# EAGLE design M228pnames (EAGLE 6.6.0)
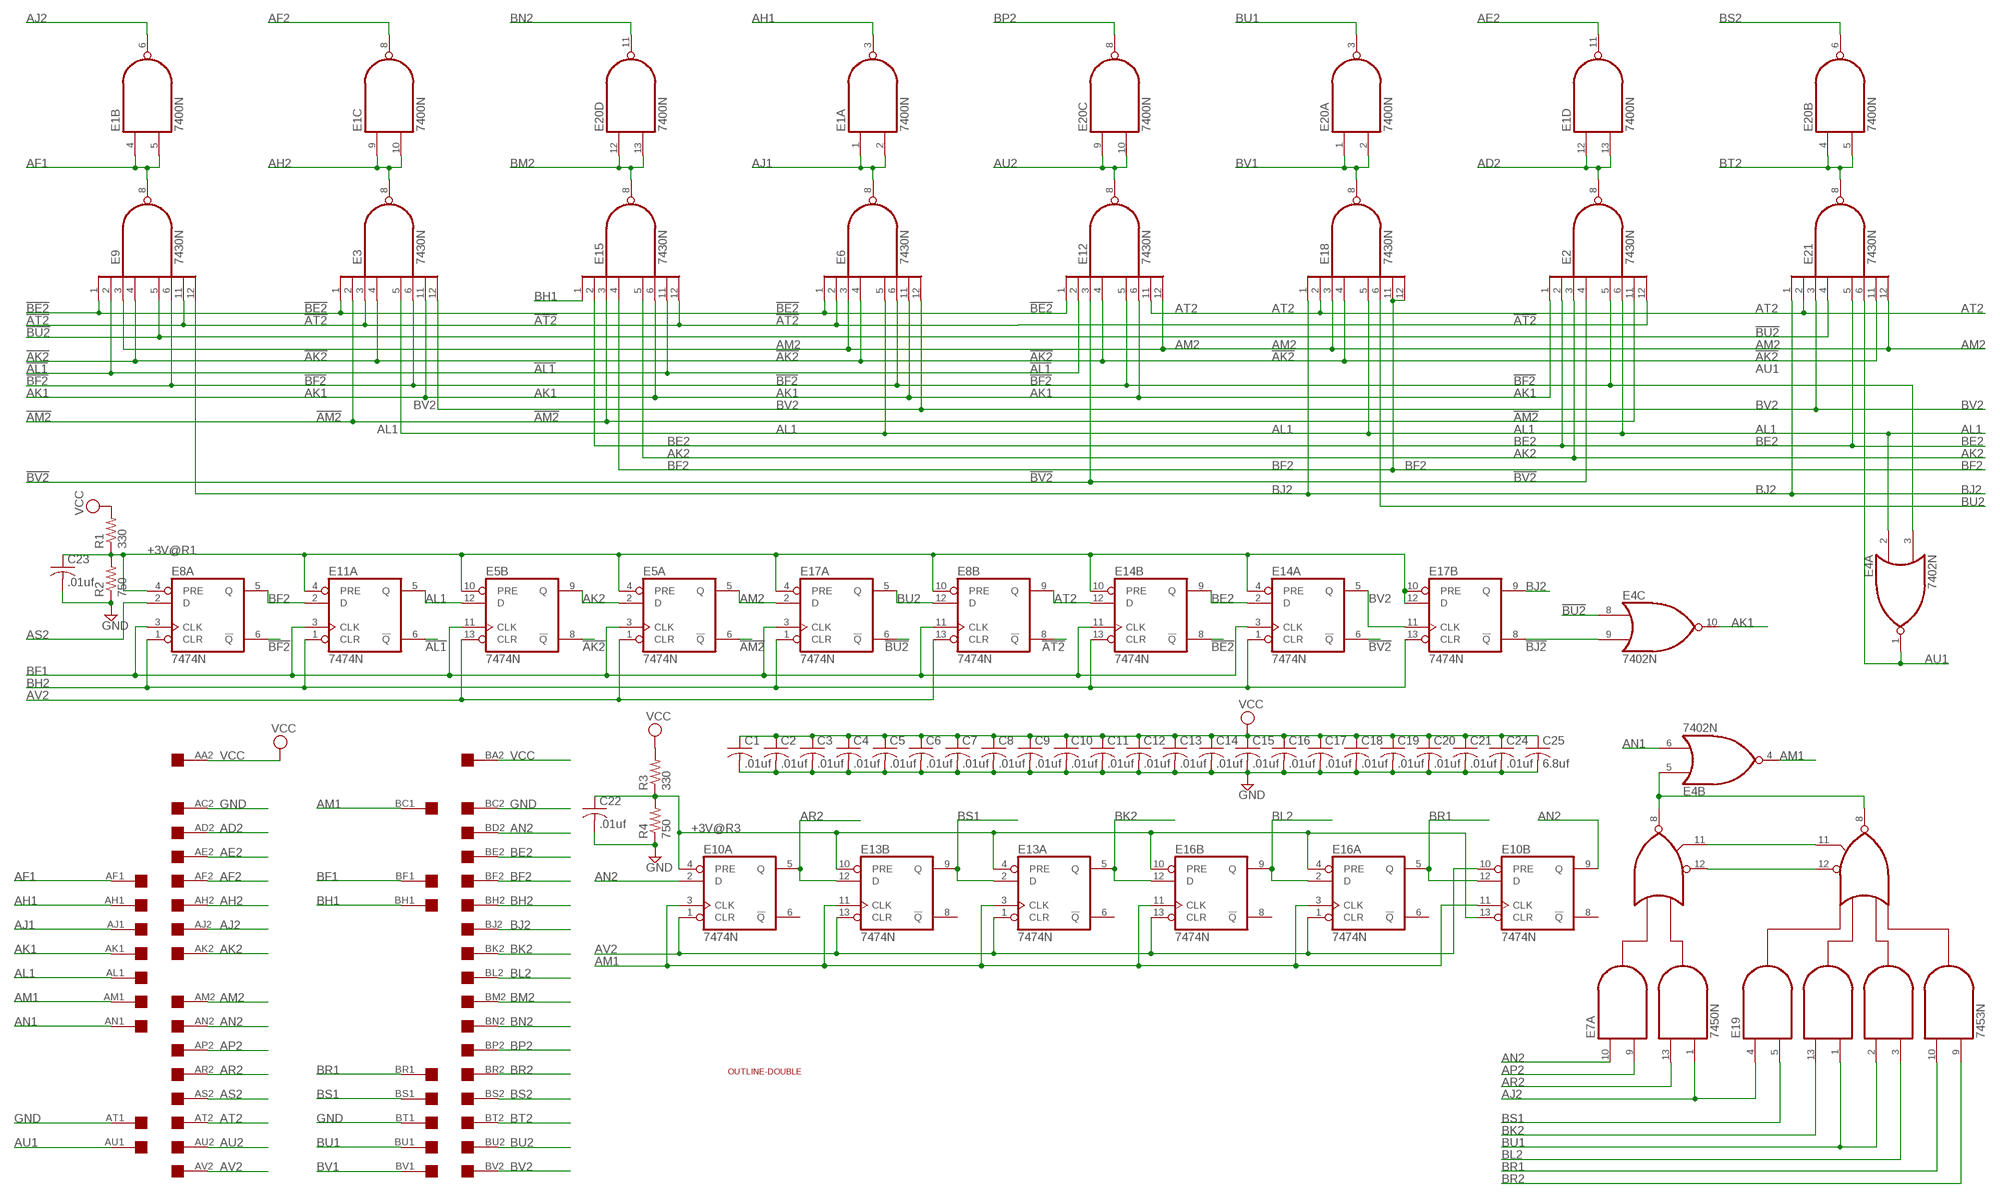
[diagram p0: schematic, sheet 1]

## Parts
C1  .01uf  C-US050-025X075  [C050-025X075]
C2  .01uf  C-US050-025X075  [C050-025X075]
C3  .01uf  C-US050-025X075  [C050-025X075]
C4  .01uf  C-US050-025X075  [C050-025X075]
C5  .01uf  C-US050-025X075  [C050-025X075]
C6  .01uf  C-US050-025X075  [C050-025X075]
C7  .01uf  C-US050-025X075  [C050-025X075]
C8  .01uf  C-US050-025X075  [C050-025X075]
C9  .01uf  C-US050-025X075  [C050-025X075]
C10  .01uf  C-US050-025X075  [C050-025X075]
C11  .01uf  C-US050-025X075  [C050-025X075]
C12  .01uf  C-US050-025X075  [C050-025X075]
C13  .01uf  C-US050-025X075  [C050-025X075]
C14  .01uf  C-US050-025X075  [C050-025X075]
C15  .01uf  C-US050-025X075  [C050-025X075]
C16  .01uf  C-US050-025X075  [C050-025X075]
C17  .01uf  C-US050-025X075  [C050-025X075]
C18  .01uf  C-US050-025X075  [C050-025X075]
C19  .01uf  C-US050-025X075  [C050-025X075]
C20  .01uf  C-US050-025X075  [C050-025X075]
C21  .01uf  C-US050-025X075  [C050-025X075]
C22  .01uf  C-US050-025X075  [C050-025X075]
C23  .01uf  C-US050-025X075  [C050-025X075]
C24  .01uf  C-US050-025X075  [C050-025X075]
C25  6.8uf  C-US150-054X183  [C150-054X183]
E1  7400N  [DIL14]
E2  7430N  [DIL14]
E3  7430N  [DIL14]
E4  7402N  [DIL14]
E5  7474N  74S74N  [DIL14]
E6  7430N  [DIL14]
E7  7450N  [DIL14]
E8  7474N  74S74N  [DIL14]
E9  7430N  [DIL14]
E10  7474N  74S74N  [DIL14]
E11  7474N  74S74N  [DIL14]
E12  7430N  [DIL14]
E13  7474N  74S74N  [DIL14]
E14  7474N  74S74N  [DIL14]
E15  7430N  [DIL14]
E16  7474N  74S74N  [DIL14]
E17  7474N  74S74N  [DIL14]
E18  7430N  [DIL14]
E19  7453N  [DIL14]
E20  7400N  [DIL14]
E21  7430N  [DIL14]
R1  330  R-US_0207/10  [0207/10]
R2  750  R-US_0207/10  [0207/10]
R3  330  R-US_0207/10  [0207/10]
R4  750  R-US_0207/10  [0207/10]
U$1  DOUBLE  [EDGE-CON4]
U$2  OUTLINE-DOUBLE  [DOUBLE]

## Nets
!AK2: E3.4(I3) E5.8(B:!Q) E6.4(I3) E9.4(I3) E12.4(I3) E18.4(I3) E21.11(I6)
!AL1: E9.2(I1) E11.6(A:!Q) E12.2(I1) E15.11(I6)
!AM2: E2.11(I6) E3.2(I1) E5.6(A:!Q) E15.3(I2)
!AT2: E2.12(I7) E3.3(I2) E6.2(I1) E8.8(B:!Q) E9.11(I6) E15.12(I7)
!BE2: E3.1(I0) E6.1(I0) E9.1(I0) E12.1(I0) E14.8(B:!Q)
!BF2: E2.5(I4) E3.6(I5) E4.3(A:I1) E6.6(I5) E8.6(A:!Q) E9.6(I5) E12.5(I4)
!BJ2: E4.9(C:I1) E17.8(B:!Q)
!BU2: E4.8(C:I0) E9.5(I4) E17.6(A:!Q) E21.4(I3)
!BV2: E2.4(I3) E12.3(I2) E14.6(A:!Q)
+3V@R1: C23.1 E5.4(A:PRE) E5.10(B:PRE) E8.4(A:PRE) E8.10(B:PRE) E11.4(A:PRE) E14.4(A:PRE) E14.10(B:PRE) E17.4(A:PRE) E17.10(B:PRE) E17.12(B:D) R1.1 R2.2
+3V@R3: C22.1 E10.4(A:PRE) E10.13(B:CLR) E13.4(A:PRE) E13.10(B:PRE) E16.4(A:PRE) E16.10(B:PRE) R3.1 R4.2
AD2: E1.12(D:I0) E1.13(D:I1) E2.8(O) U$1.AD2
AE2: E1.11(D:O) U$1.AE2
AF1: E1.4(B:I0) E1.5(B:I1) E9.8(O) U$1.AF1
AF2: E1.8(C:O) U$1.AF2
AH1: E1.3(A:O) U$1.AH1
AH2: E1.9(C:I0) E1.10(C:I1) E3.8(O) U$1.AH2
AJ1: E1.1(A:I0) E1.2(A:I1) E6.8(O) U$1.AJ1
AJ2: E1.6(B:O) E7.1(A:I4) E19.4(I1) U$1.AJ2
AK1: E2.1(I0) E3.11(I6) E4.10(C:O) E6.11(I6) E12.6(I5) E15.6(I5) U$1.AK1
AK2: E2.3(I2) E5.2(A:D) E5.9(B:Q) E15.5(I4) U$1.AK2
AL1: E2.6(I5) E3.5(I4) E4.2(A:I0) E5.12(B:D) E6.5(I4) E11.5(A:Q) E18.5(I4) U$1.AL1
AM1: E4.4(B:O) E10.3(A:CLK) E10.11(B:CLK) E13.3(A:CLK) E13.11(B:CLK) E16.3(A:CLK) E16.11(B:CLK) U$1.AM1 U$1.BC1
AM2: E5.5(A:Q) E6.3(I2) E9.3(I2) E12.12(I7) E17.2(A:D) E18.3(I2) E21.12(I7) U$1.AM2
AN1: E4.6(B:I1) U$1.AN1
AN2: E7.10(A:I1) E10.2(A:D) E10.9(B:Q) U$1.AN2 U$1.BD2
AP2: E7.9(A:I2) U$1.AP2
AR2: E7.13(A:I3) E10.5(A:Q) E13.12(B:D) U$1.AR2
AS2: E8.2(A:D) U$1.AS2
AT2: E8.9(B:Q) E12.11(I6) E14.12(B:D) E18.2(I1) E21.2(I1) U$1.AT2
AU1: E4.1(A:O) E21.6(I5) U$1.AU1
AU2: E12.8(O) E20.9(C:I0) E20.10(C:I1) U$1.AU2
AV2: E5.1(A:CLR) E5.13(B:CLR) E8.13(B:CLR) E10.1(A:CLR) E10.10(B:PRE) E13.1(A:CLR) E13.13(B:CLR) E16.1(A:CLR) E16.13(B:CLR) U$1.AV2
BE2: E2.2(I1) E14.2(A:D) E14.9(B:Q) E15.2(I1) E21.5(I4) U$1.BE2
BF1: E5.3(A:CLK) E5.11(B:CLK) E8.3(A:CLK) E8.11(B:CLK) E11.3(A:CLK) E14.3(A:CLK) E14.11(B:CLK) E17.3(A:CLK) U$1.BF1
BF2: E8.5(A:Q) E11.2(A:D) E15.4(I3) E18.11(I6) E18.12(I7) U$1.BF2
BH1: E15.1(I0) U$1.BH1
BH2: E8.1(A:CLR) E11.1(A:CLR) E14.1(A:CLR) E14.13(B:CLR) E17.1(A:CLR) E17.13(B:CLR) U$1.BH2
BJ2: E9.12(I7) E17.9(B:Q) E18.1(I0) E21.1(I0) U$1.BJ2
BK2: E13.5(A:Q) E16.12(B:D) E19.13(I3) U$1.BK2
BL2: E16.2(A:D) E16.9(B:Q) E19.3(I6) U$1.BL2
BM2: E15.8(O) E20.12(D:I0) E20.13(D:I1) U$1.BM2
BN2: E20.11(D:O) U$1.BN2
BP2: E20.8(C:O) U$1.BP2
BR1: E10.12(B:D) E16.5(A:Q) E19.10(I7) U$1.BR1
BR2: E19.9(I8) U$1.BR2
BS1: E13.2(A:D) E13.9(B:Q) E19.5(I2) U$1.BS1
BS2: E20.6(B:O) U$1.BS2
BT2: E20.4(B:I0) E20.5(B:I1) E21.8(O) U$1.BT2
BU1: E19.1(I4) E19.2(I5) E20.3(A:O) U$1.BU1
BU2: E8.12(B:D) E17.5(A:Q) E18.6(I5) U$1.BU2
BV1: E18.8(O) E20.1(A:I0) E20.2(A:I1) U$1.BV1
BV2: E3.12(I7) E6.12(I7) E14.5(A:Q) E17.11(B:CLK) E21.3(I2) U$1.BV2
GND: C1.2 C2.2 C3.2 C4.2 C5.2 C6.2 C7.2 C8.2 C9.2 C10.2 C11.2 C12.2 C13.2 C14.2 C15.2 C16.2 C17.2 C18.2 C19.2 C20.2 C21.2 C22.2 C23.2 C24.2 C25.2 R2.1 R4.1 U$1.AC2 U$1.AT1 U$1.BC2 U$1.BT1
N$1: E7.12(A:I5) E19.12(I9)
N$2: E7.11(A:I6) E19.11(I10)
N$3: E4.5(B:I0) E7.8(A:O) E19.8(O)
VCC: C1.1 C2.1 C3.1 C4.1 C5.1 C6.1 C7.1 C8.1 C9.1 C10.1 C11.1 C12.1 C13.1 C14.1 C15.1 C16.1 C17.1 C18.1 C19.1 C20.1 C21.1 C24.1 C25.1 R1.2 R3.2 U$1.AA2 U$1.BA2
Unconnected: E4.11(D:I0) E4.12(D:I1) E4.13(D:O) E7.2(B:I1) E7.3(B:I2) E7.4(B:I3) E7.5(B:I4) E7.6(B:O) E10.6(A:!Q) E10.8(B:!Q) E11.8(B:!Q) E11.9(B:Q) E11.10(B:PRE) E11.11(B:CLK) E11.12(B:D) E11.13(B:CLR) E13.6(A:!Q) E13.8(B:!Q) E16.6(A:!Q) E16.8(B:!Q) E19.6(SPARE) U$1.AA1 U$1.AB1 U$1.AB2 U$1.AC1 U$1.AD1 U$1.AE1 U$1.AL2 U$1.AP1 U$1.AR1 U$1.AS1 U$1.AV1 U$1.BA1 U$1.BB1 U$1.BB2 U$1.BD1 U$1.BE1 U$1.BJ1 U$1.BK1 U$1.BL1 U$1.BM1 U$1.BN1 U$1.BP1

## Power pins joined to a net without a drawn wire
GND: E1.7(P:GND) E2.7(GND) E3.7(GND) E4.7(P:GND) E5.7(P:GND) E6.7(GND) E7.7(P:GND) E8.7(P:GND) E9.7(GND) E10.7(P:GND) E11.7(P:GND) E12.7(GND) E13.7(P:GND) E14.7(P:GND) E15.7(GND) E16.7(P:GND) E17.7(P:GND) E18.7(GND) E19.7(GND) E20.7(P:GND) E21.7(GND)
VCC: E1.14(P:VCC) E2.14(VCC) E3.14(VCC) E4.14(P:VCC) E5.14(P:VCC) E6.14(VCC) E7.14(P:VCC) E8.14(P:VCC) E9.14(VCC) E10.14(P:VCC) E11.14(P:VCC) E12.14(VCC) E13.14(P:VCC) E14.14(P:VCC) E15.14(VCC) E16.14(P:VCC) E17.14(P:VCC) E18.14(VCC) E19.14(VCC) E20.14(P:VCC) E21.14(VCC)

## Library data of the parts
C1-C25 = rcl:C-US: CAPACITOR, American symbol
E1 E20 = 74xx-us:74*00: Quad 2-input NAND gate
E2 E3 E6 E9 E12 E15 E18 E21 = 74xx-us:74*30: 8-input NAND gate
E4 = 74xx-us:74*02: Quad 2-input NOR gate
E5 E8 E10 E11 E13 E14 E16 E17 = 74xx-us:74*74: Dual D type positive edge triggered FLIP FLOP, preset and clear
E7 = dec-con:74*50: 4-2-3-2 input AND OR INVERTER gates
E19 = dec-con:74*53: 4-2-3-2 input AND OR INVERTER gates
R1-R4 = rcl:R-US_: RESISTOR, American symbol
U$1 = dec-con:DOUBLE: Double-Height DEC board
U$2 = dec-con:OUTLINE-*: Board outlines for DEC boards.

## Board
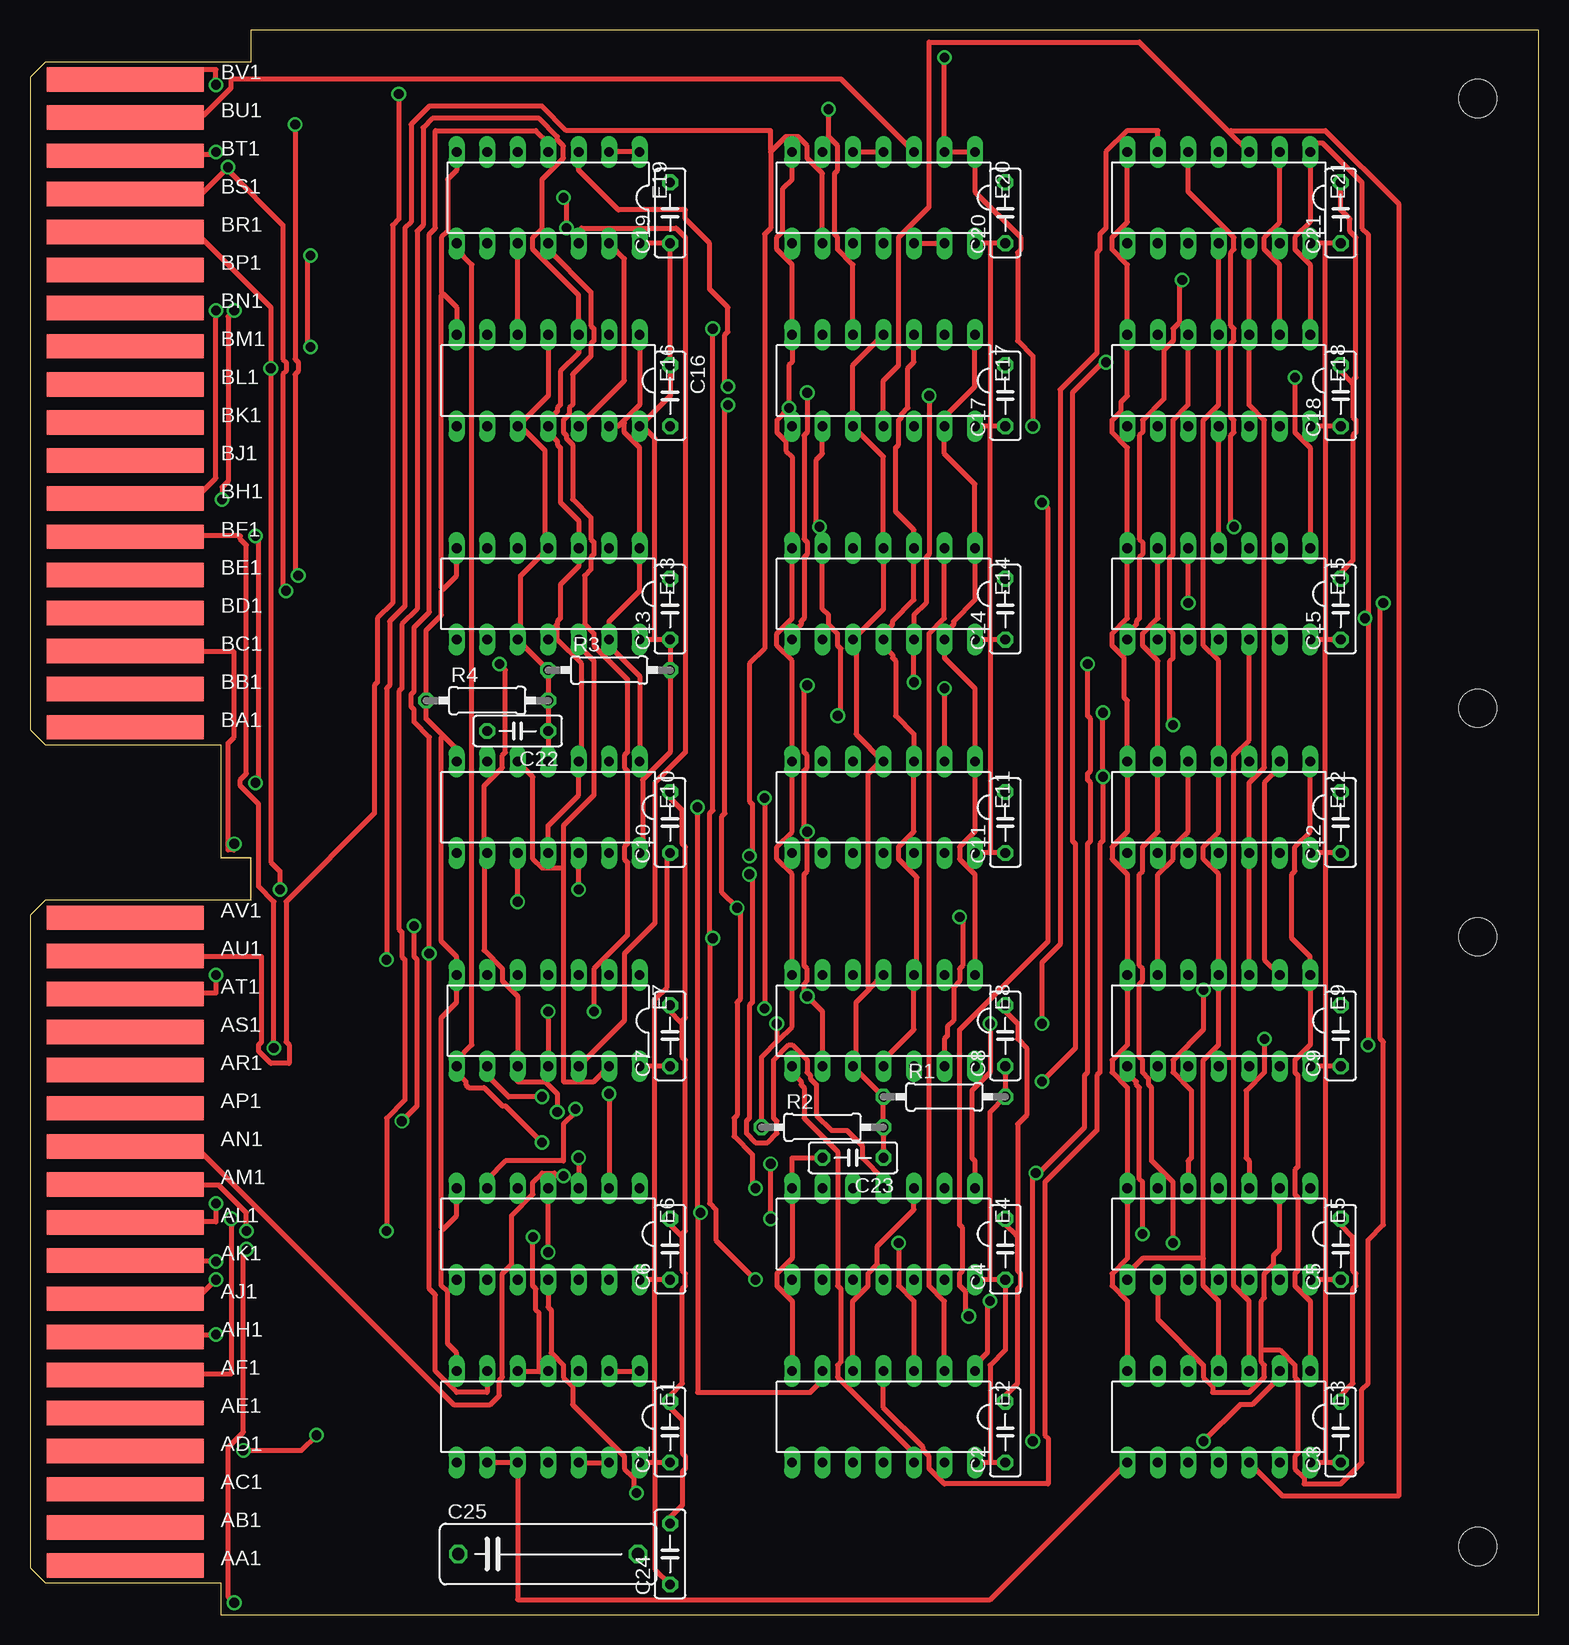
[diagram p1: board, top side]
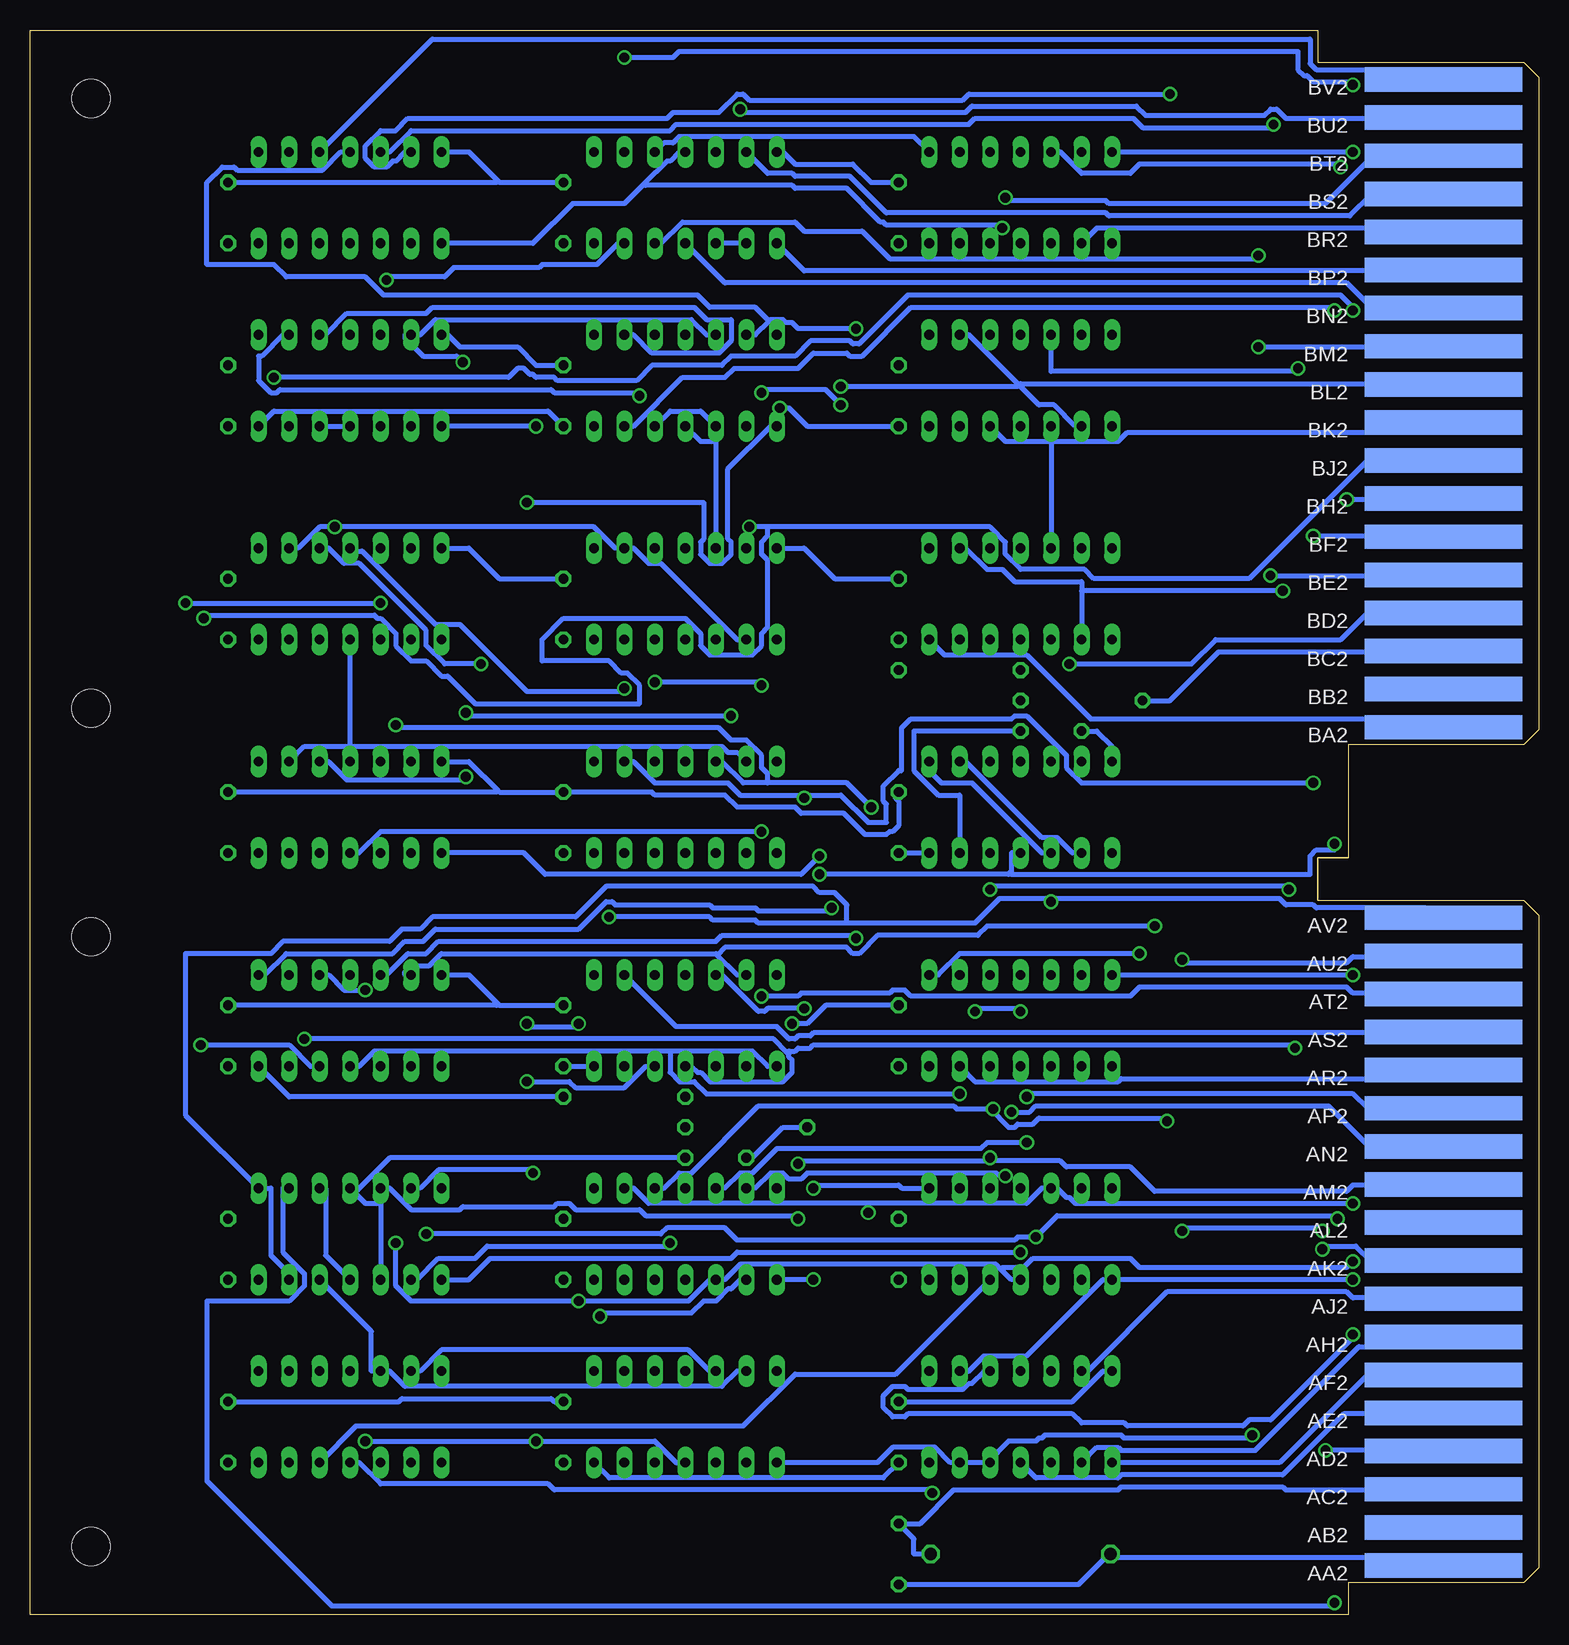
[diagram p2: board, bottom side, seen from below]

Size 125.73 x 132.08 mm. Coordinates in mm from the lower left corner, seen from the top.
Copper layers (1+16): Top 0.035mm / dielectric 1.5mm / Bottom 0.035mm
Design rules "16mils": minimum track width 16mil, minimum drill 32mil, track to track 15mil, track to pad 10mil, pad to pad 10mil, via to via 10mil, smd to smd 10mil, copper to edge 13mil, drill to drill 10mil, minimum pad ring 10mil, minimum via ring 8mil, stop-mask expansion 0mil, vias tented up to drill 0mil, thermal gap 10mil
vRestrict: area 31.8,108 to 41.9,125.7; area 49.5,108 to 59.7,125.7; area 67.3,108 to 77.5,125.7; area 85.1,108 to 95.3,125.7; area 102.9,108 to 113,125.7; area 31.8,80 to 41.9,97.8; area 49.5,80 to 59.7,97.8; area 67.3,80 to 77.5,97.8; area 85.1,80 to 95.3,97.8; area 31.8,34.3 to 41.9,52.1; area 49.5,34.3 to 59.7,52.1; area 67.3,34.3 to 77.5,52.1; area 85.1,34.3 to 95.3,52.1; area 102.9,11.4 to 113,29.2; area 85.1,11.4 to 95.3,29.2; area 49.5,11.4 to 59.7,29.2; area 31.8,11.4 to 41.9,29.2; area 67.3,11.4 to 77.5,29.2

### Footprints (pad centres in the part's own frame; a part is rotated, then mirrored left to right if it is on the bottom)
C050-025X075 = drill 0.813 octagon: 1 -2.54,0; 2 2.54,0
C150-054X183 = drill 1.016 octagon: 1 -7.493,0; 2 7.493,0
DIL14 = drill 0.813 long: 1 -7.62,-3.81; 2 -5.08,-3.81; 3 -2.54,-3.81; 4 0,-3.81; 5 2.54,-3.81; 6 5.08,-3.81; 7 7.62,-3.81; 8 7.62,3.81; 9 5.08,3.81; 10 2.54,3.81; 11 0,3.81; 12 -2.54,3.81; 13 -5.08,3.81; 14 -7.62,3.81
0207/10 = drill 0.813 octagon: 1 -5.08,0; 2 5.08,0
EDGE-CON4 = smd 13.106 x 2.032: AA1 7.938,4.128; AB1 7.938,7.303; AC1 7.938,10.477; AD1 7.938,13.652; AE1 7.938,16.828; AF1 7.938,20.003; AH1 7.938,23.177; AJ1 7.938,26.352; AK1 7.938,29.527; AL1 7.938,32.703; AM1 7.938,35.877; AN1 7.938,39.053; AP1 7.938,42.227; AR1 7.938,45.403; AS1 7.938,48.578; AT1 7.938,51.752; AU1 7.938,54.928; AV1 7.938,58.102; BA1 7.938,73.978; BB1 7.938,77.153; BC1 7.938,80.328; BD1 7.938,83.502; BE1 7.938,86.677; BF1 7.938,89.853; BH1 7.938,93.028; BJ1 7.938,96.203; BK1 7.938,99.377; BL1 7.938,102.552; BM1 7.938,105.728; BN1 7.938,108.903; BP1 7.938,112.078; BR1 7.938,115.252; BS1 7.938,118.427; BT1 7.938,121.603; BU1 7.938,124.778; BV1 7.938,127.953 | smd 13.106 x 2.032 bottom: AA2 7.938,4.128; AB2 7.938,7.303; AC2 7.938,10.477; AD2 7.938,13.652; AE2 7.938,16.828; AF2 7.938,20.003; AH2 7.938,23.177; AJ2 7.938,26.352; AK2 7.938,29.527; AL2 7.938,32.703; AM2 7.938,35.877; AN2 7.938,39.053; AP2 7.938,42.227; AR2 7.938,45.403; AS2 7.938,48.578; AT2 7.938,51.752; AU2 7.938,54.928; AV2 7.938,58.102; BA2 7.938,73.978; BB2 7.938,77.153; BC2 7.938,80.328; BD2 7.938,83.502; BE2 7.938,86.677; BF2 7.938,89.853; BH2 7.938,93.028; BJ2 7.938,96.203; BK2 7.938,99.377; BL2 7.938,102.552; BM2 7.938,105.728; BN2 7.938,108.903; BP2 7.938,112.078; BR2 7.938,115.252; BS2 7.938,118.427; BT2 7.938,121.603; BU2 7.938,124.778; BV2 7.938,127.953
DOUBLE = hole 3.175: 120.65,56.515; 120.65,5.715; 120.65,75.565; 120.65,126.365

### Placement (x,y rotation side)
C1  53.34,15.24 90 top
C2  81.28,15.24 90 top
C3  109.22,15.24 90 top
C4  81.28,30.48 90 top
C5  109.22,30.48 90 top
C6  53.34,30.48 90 top
C7  53.34,48.26 90 top
C8  81.28,48.26 90 top
C9  109.22,48.26 90 top
C10  53.34,66.04 90 top
C11  81.28,66.04 90 top
C12  109.22,66.04 90 top
C13  53.34,83.82 90 top
C14  81.28,83.82 90 top
C15  109.22,83.82 90 top
C16  53.34,101.6 270 top
C17  81.28,101.6 90 top
C18  109.22,101.6 90 top
C19  53.34,116.84 90 top
C20  81.28,116.84 90 top
C21  109.22,116.84 90 top
C22  40.64,73.66 180 top
C23  68.58,38.1 180 top
C24  53.34,5.08 90 top
C25  43.18,5.08 0 top
E1  43.18,16.51 180 top
E2  71.12,16.51 180 top
E3  99.06,16.51 180 top
E4  71.12,31.75 180 top
E5  99.06,31.75 180 top
E6  43.18,31.75 180 top
E7  43.18,49.53 180 top
E8  71.12,49.53 180 top
E9  99.06,49.53 180 top
E10  43.18,67.31 180 top
E11  71.12,67.31 180 top
E12  99.06,67.31 180 top
E13  43.18,85.09 180 top
E14  71.12,85.09 180 top
E15  99.06,85.09 180 top
E16  43.18,102.87 180 top
E17  71.12,102.87 180 top
E18  99.06,102.87 180 top
E19  43.18,118.11 180 top
E20  71.12,118.11 180 top
E21  99.06,118.11 180 top
R1  76.2,43.18 0 top
R2  66.04,40.64 0 top
R3  48.26,78.74 0 top
R4  38.1,76.2 0 top
U$1  0,0 0 top
U$2  0,0 0 top

### Tracks (layer width: path | path; a pad name or v marks a point on that pad's centre or on a via)
!AK2  (via drill 0.81)
  Top 0.406: v43.18,30.23 E6.4 | 97.79,29.72 97.79,27.43 99.06,26.16 E3.4 | 97.79,29.72 97.79,46.23 99.06,47.5 E9.4 99.06,61.72 97.79,62.99 97.79,64.01 99.06,65.28 E12.4 99.06,79.5 97.79,80.77 97.79,99.57 99.06,100.84 E18.4 E21.11 | E5.8 91.44,28.45 92.71,29.72 97.79,29.72
  Bottom 0.406: v43.18,30.23 66.8,30.23 67.31,29.72 87.38,29.72 89.15,27.94 E5.8
!AL1
  Top 0.406: E9.2 102.87,54.61 102.87,69.34 104.14,70.61 E12.2
  Bottom 0.406: E11.6 66.8,71.88 67.56,71.88 68.07,72.39 99.06,72.39 | 99.06,72.39 102.87,72.39 E12.2 | 99.06,72.39 E15.11
!AM2  (via drill 0.81)
  Top 0.406: v97.79,14.48 100.84,17.53 101.85,17.53 104.14,19.81 E3.2 | v83.57,14.48 83.57,36.58 v83.82,36.83 83.82,36.58 87.88,40.64 87.88,44.96 88.14,45.21 88.14,64.26 88.39,64.52 88.39,69.34 88.14,69.6 88.14,70.1 88.39,70.36 88.39,74.68 88.14,74.93 v88.14,79.25
  Bottom 0.406: E2.11 71.88,12.7 73.66,14.48 v83.57,14.48 v97.79,14.48 | E5.6 93.22,35.56 91.69,37.08 84.07,37.08 v83.82,36.83 | E15.3 100.84,88.9 99.57,87.63 98.3,87.63 92.71,82.04 92.71,80.77 91.19,79.25 v88.14,79.25
!AT2  (via drill 0.81)
  Top 0.406: E15.12 101.6,72.9 100.33,71.63 100.33,46.48 | 100.33,46.48 100.33,27.43 101.6,26.16 E3.3 | v48.26,43.43 E6.2 | E2.12 73.66,13.46 67.31,19.81 67.31,20.83 67.56,21.08 67.56,27.18 67.31,27.43 67.31,38.61 64.52,41.4 64.52,43.94 64.26,44.2 64.26,44.45 63.5,45.21 E8.8 | 100.33,46.48 99.31,46.48 99.06,46.23 E9.11
  Bottom 0.406: E9.11 98.3,45.72 97.03,46.99 72.39,46.99 | 72.39,46.99 65.53,46.99 64.26,45.72 E8.8 | v48.26,43.43 69.34,43.43 70.36,44.45 71.63,44.45 72.39,45.21 72.39,46.99
!BE2  (via drill 0.81)
  Top 0.406: v60.45,35.56 60.2,35.81 60.2,38.35 58.67,39.88 58.67,41.4 58.93,41.66 58.93,51.05 59.18,51.31 59.18,58.67 v58.93,58.93 57.66,60.2 57.66,66.55 57.91,66.8 57.91,100.58 v58.17,100.84 | E14.8 63.5,81.79 64.26,82.55 64.26,82.8 64.52,83.06 64.52,88.14 64.77,88.39 64.77,89.41 64.52,89.66 64.52,98.3 64.77,98.55 v64.77,101.85 | E3.1 106.68,26.16 105.41,27.43 105.41,28.45 105.66,28.7 105.66,34.8 105.41,35.05 105.41,37.08 105.66,37.34 105.66,44.96 105.41,45.21 105.41,46.23 106.68,47.5 E9.1 106.68,54.86 105.16,56.39 105.16,61.72 105.41,61.98 105.41,64.01 106.68,65.28 E12.1
  Bottom 0.406: E6.1 53.09,35.56 53.34,35.81 60.2,35.81 v60.45,35.56 | v58.93,58.93 59.18,58.67 65.02,58.67 65.28,58.93 68.83,58.93 69.09,59.18 76.96,59.18 77.22,59.44 77.72,59.44 80.01,57.15 91.95,57.15 92.96,56.13 94.49,56.13 95.5,55.12 104.39,55.12 106.17,53.34 E9.1 | v64.77,101.85 64.52,102.11 59.44,102.11 v58.17,100.84
!BF2  (via drill 0.81)
  Top 0.406: E12.5 96.52,65.28 95.25,64.01 95.25,62.99 93.98,61.72 E9.6 | E4.3 73.66,33.78 70.61,30.73 70.61,29.21 69.85,28.45 69.85,27.43 68.58,26.16 E2.5 | E6.6 38.1,36.32 39.62,37.85 44.45,37.85 44.45,40.89 45.47,41.91 v45.47,42.16 | v32,57.4 32,54.86 32.26,54.61 32.26,42.42 v30.99,41.15
  Bottom 0.406: E8.6 66.8,53.34 68.45,54.99 | 68.45,54.99 68.58,55.12 91.44,55.12 92.46,54.1 93.98,54.1 94.49,53.59 94.49,53.34 E9.6 | 45.72,42.16 48.51,42.16 48.77,42.42 65.02,42.42 70.61,36.83 71.63,36.83 72.9,35.56 E4.3 | E3.6 93.22,20.32 91.44,22.1 70.87,22.1 69.09,20.32 E2.5 | 68.45,54.99 67.82,55.63 57.66,55.63 57.15,55.12 56.64,55.12 55.12,56.64 46.74,56.64 45.97,57.4 v32,57.4 | v30.99,41.15 31.24,41.4 41.66,41.4 42.16,40.89 43.43,40.89 43.69,40.64 44.2,40.64 45.72,42.16 | 45.72,42.16 v45.47,42.16
!BJ2  (via drill 0.81)
  Top 0.406: v84.33,92.71 84.84,92.2 84.84,56.13 77.47,48.77 77.47,32.51 77.72,32.26 77.72,28.7 77.47,28.45 77.47,27.43 77.98,26.92 77.98,25.15 v78.23,24.89
  Bottom 0.406: E17.8 64.01,99.06 67.56,95.5 67.56,89.66 67.31,89.41 67.31,88.39 68.07,87.63 69.09,87.63 69.85,88.39 69.85,89.41 69.6,89.66 69.6,92.71 v84.33,92.71 | v78.23,24.89 77.98,25.15 70.61,25.15 69.6,26.16 68.58,26.16 67.56,27.18 67.31,27.18 66.55,27.94 E4.9
!BU2  (via drill 0.81)
  Top 0.406: v60.45,27.94 57.15,31.24 57.15,33.78 56.64,34.29 56.64,56.13 v56.9,56.39 56.64,56.39 56.64,66.8 56.9,67.06 v56.9,107.19
  Bottom 0.406: v60.45,27.94 E4.8 | v56.9,56.39 57.15,56.64 68.07,56.64 68.58,56.13 91.69,56.13 92.71,55.12 94.23,55.12 96.01,53.34 E9.5 | E17.6 65.28,106.68 64.14,107.82 | 64.14,107.82 64.01,107.95 62.99,107.95 62.74,107.7 62.23,107.7 61.72,107.19 v56.9,107.19 | E21.4 99.82,121.92 101.35,120.4 108.46,120.4 108.71,120.65 109.73,120.65 111,119.38 111,112.52 105.41,112.52 104.39,111.51 97.79,111.51 96.27,109.98 70.1,109.98 69.09,108.97 65.28,108.97 64.14,107.82
!BV2  (via drill 0.81)
  Top 0.406: E2.4 71.12,17.27 74.42,13.97 74.42,13.72 74.93,13.21 74.93,12.19 76.2,10.92 84.84,10.92 84.84,14.73 84.58,14.99 84.58,36.07 88.9,40.39 88.9,44.96 89.15,45.21 89.15,64.26 89.41,64.52 v89.41,69.85 v89.41,75.18 | E14.6 66.04,83.82 66.55,83.31 66.55,82.55 67.31,81.79 67.31,80.77 67.56,80.52 67.56,75.18 v67.31,74.93
  Bottom 0.406: v89.41,69.85 89.66,69.6 99.31,69.6 100.84,71.12 E12.3 | v67.31,74.93 89.15,74.93 v89.41,75.18
+3V@R1
  Top 0.406: E17.4 68.58,104.14 E17.10 71.12,96.52 E14.4 71.12,83.82 E14.10 68.83,81.28 68.83,73.41 E11.4 70.87,71.12 69.85,70.1 69.85,52.32 69.98,52.2 | C23.1 R2.2 R1.1 E8.10 68.83,45.72 68.83,51.05 69.98,52.2 | 69.98,52.2 E8.4
  Bottom 0.406: E17.10 69.85,100.33 72.39,100.33 E17.12 | E5.10 96.52,34.29 97.79,34.29 E5.4 98.55,35.31 95.76,38.1 C23.1
+3V@R3
  Top 0.406: E10.4 C22.1 R4.2 R3.1 E13.10 40.89,81.28 40.89,86.61 E13.4 42.93,88.9 42.93,97.03 40.89,99.06 E16.10 43.18,101.6 E16.4
  Bottom 0.406: E10.13 48.26,68.33 50.04,68.33 52.07,70.36 52.07,73.66 C22.1
AD2  (via drill 0.81)
  Top 0.406: E1.12 E1.13 | v23.88,14.99 22.61,13.72 v17.78,13.72
  Bottom 0.406: E2.8 55.12,12.7 53.85,13.97 50.29,13.97 49.02,12.7 E1.13 45.97,12.7 44.2,14.48 41.91,14.48 41.66,14.73 41.4,14.73 41.15,14.99 34.8,14.99 34.54,14.73 24.13,14.73 v23.88,14.99 | v17.78,13.72 8.13,13.72 U$1.AD2
AE2
  Bottom 0.406: E1.11 41.91,11.43 35.05,11.43 34.8,11.68 21.34,11.68 16.26,16.76 8.13,16.76 U$1.AE2
AF1  (via drill 0.81)
  Top 0.406: E1.5 42.42,20.32 | 42.42,20.32 E1.4 | E9.8 91.44,45.21 92.2,44.45 92.2,44.2 92.46,43.94 92.46,36.32 92.71,36.07 v92.71,31.75 | v41.91,31.5 41.91,27.43 42.16,27.18 42.16,25.4 42.42,25.15 42.42,20.32 | v16.76,33.02 16.76,20.07 8.13,20.07 U$1.AF1
  Bottom 0.406: v92.71,31.75 73.15,31.75 72.64,32.26 67.82,32.26 66.8,31.24 43.69,31.24 43.43,31.5 v41.91,31.5 40.13,33.27 17.02,33.27 v16.76,33.02
AF2
  Bottom 0.406: E1.8 21.59,12.7 14.48,19.81 8.13,19.81 U$1.AF2
AH1  (via drill 0.81)
  Top 0.406: v15.49,23.37 10.41,23.37 10.16,23.11 8.13,23.11 U$1.AH1
  Bottom 0.406: E1.3 46.23,20.32 47.24,19.3 47.5,19.3 48.01,18.8 52.58,18.8 52.83,19.05 53.85,19.05 54.61,18.29 54.61,17.27 53.85,16.51 52.83,16.51 52.58,16.76 38.86,16.76 38.1,16 34.54,16 34.29,15.75 24.64,15.75 24.13,16.26 22.35,16.26 15.49,23.11 v15.49,23.37
AH2
  Top 0.406: E1.9 E1.10 40.64,1.27 80.01,1.27 E3.8
  Bottom 0.406: E1.9 36.83,13.97 35.05,13.97 34.8,13.72 23.62,13.72 14.99,22.35 8.89,22.35 8.13,23.11 U$1.AH2
AJ1  (via drill 0.81)
  Top 0.406: E1.2 E1.1 | v15.49,27.94 13.97,26.42 8.13,26.42 U$1.AJ1
  Bottom 0.406: E1.2 47.5,20.32 46.23,21.59 42.67,21.59 36.32,27.94 E6.8 v15.49,27.94
AJ2  (via drill 0.81)
  Top 0.406: E1.6 38.1,18.54 35.56,18.54 33.78,20.32 33.78,26.67 33.27,27.18 v33.27,55.12 33.27,73.15 32,74.42 32,75.44 31.75,75.69 31.75,76.71 32,76.96 32,82.3 33.27,83.57 33.27,115.06 33.78,115.57 33.78,123.7 42.16,123.7 43.18,122.68 E19.4
  Bottom 0.406: E1.6 37.59,20.32 30.99,26.92 16,26.92 15.49,26.42 8.13,26.42 U$1.AJ2 | E7.1 50.04,53.34 48.26,55.12 v33.27,55.12
AK1  (via drill 0.81)
  Top 0.406: E15.6 93.98,83.06 92.71,81.79 92.71,80.77 93.98,79.5 E12.6 93.98,65.28 92.71,64.01 92.71,61.98 92.46,61.72 92.46,54.1 92.71,53.85 92.71,52.83 92.46,52.58 92.46,46.48 92.71,46.23 92.71,45.21 93.22,44.7 93.22,44.2 93.47,43.94 93.47,37.85 95.25,36.07 v95.25,30.99 | E2.1 78.74,20.83 79.76,21.84 79.76,25.91 v80.01,26.16 | v50.55,10.16 50.29,10.41 50.29,11.43 49.53,12.19 49.53,13.21 45.21,17.53 45.21,19.05 44.45,19.81 44.45,20.83 43.43,21.84 43.43,25.4 43.18,25.65 E6.11 | v15.49,29.46 8.13,29.46 U$1.AK1
  Bottom 0.406: 44.83,28.83 43.94,27.94 E6.11 | 44.83,28.83 45.21,29.21 66.55,29.21 67.82,27.94 E4.10 69.09,27.94 70.87,26.16 v80.01,26.16 93.98,26.16 95.25,27.43 v95.25,30.99 | E3.11 98.3,12.7 96.52,10.92 82.55,10.92 82.04,10.41 50.8,10.41 v50.55,10.16 | v15.49,29.46 16,28.96 33.27,28.96 34.04,29.72 42.16,29.72 42.93,28.96 44.7,28.96 44.83,28.83
AK2  (via drill 0.81)
  Top 0.406: E2.3 73.66,26.16 72.39,27.43 v72.39,30.99 | E5.2 104.14,30.48 103.63,29.97 103.63,29.21 102.87,28.45 102.87,26.42 102.62,26.16 102.62,22.1 | 102.62,22.1 102.62,21.08 102.87,20.83 102.87,19.81 101.6,18.54 98.55,18.54 98.55,19.05 97.79,19.81 97.79,20.83 93.98,24.64 E5.9 | v96.52,84.33 E15.5 | v112.78,84.33 112.52,84.07 112.52,48.01 112.78,47.75 112.78,32.51 111.51,31.24 111.51,19.3 111,18.8 111,12.7 109.22,10.92 106.17,10.92 106.17,11.43 105.41,12.19 105.41,13.21 105.66,13.46 105.66,19.56 105.41,19.81 105.41,20.83 104.14,22.1 102.62,22.1 | v18.03,30.48 17.78,30.23 17.78,15.24 16.51,13.97 16.51,1.52 v17.02,1.02
  Bottom 0.406: v72.39,30.99 72.64,30.73 87.63,30.73 88.65,29.72 91.69,29.72 93.47,27.94 E5.9 | v112.78,84.33 v96.52,84.33 | v18.03,30.48 17.78,30.73 15.24,30.73 13.97,29.46 8.13,29.46 U$1.AK2 | v17.02,1.02 17.27,0.76 100.58,0.76 111,11.18 111,26.16 104.14,26.16 102.87,27.43 102.87,28.45 104.65,30.23 104.65,35.56 E5.2
AL1  (via drill 0.81)
  Top 0.406: v55.63,67.31 55.63,33.78 v55.88,33.53 55.63,33.53 55.63,18.54 65.02,18.54 66.04,19.56 E2.6 | E18.5 96.52,100.84 95.25,99.57 95.25,88.39 95,88.14 95,82.04 95.25,81.79 95.25,79.76 95,79.5 95,74.42 v95.25,74.17 | v15.49,34.29 15.49,32.77 8.13,32.77 U$1.AL1
  Bottom 0.406: E2.6 66.8,20.32 68.07,19.05 94.49,19.05 95.76,20.32 E3.5 97.28,20.32 97.28,23.62 E5.12 | E4.2 75.44,35.56 74.17,34.29 55.88,34.29 | 55.88,34.29 42.67,34.29 41.4,35.56 E6.5 40.13,35.56 39.37,34.8 39.12,34.8 38.61,34.29 v15.49,34.29 | E11.5 68.07,71.12 66.29,69.34 64.26,69.34 | 64.26,69.34 57.66,69.34 v55.63,67.31 | 55.88,34.29 v55.88,33.53 | v95.25,74.17 95,73.91 68.33,73.91 67.31,72.9 66.04,72.9 64.77,71.63 64.77,70.61 64.26,70.1 64.26,69.34
AM1  (via drill 0.81)
  Top 0.406: E13.11 43.18,81.79 43.82,82.42 | 43.82,82.42 43.94,82.55 43.94,82.8 44.2,83.06 44.2,85.85 45.72,87.38 E13.3 45.72,91.19 44.2,92.71 44.2,97.28 43.94,97.54 43.94,97.79 43.18,98.55 E16.11 43.18,99.57 43.94,100.33 43.94,100.58 44.2,100.84 44.2,103.63 45.72,105.16 E16.3 45.72,109.98 41.91,113.79 41.91,114.81 42.67,115.57 42.67,119.63 44.45,121.41 44.45,122.43 43.94,122.94 43.94,123.19 42.42,124.71 33.53,124.71 32.77,123.95 32.77,115.82 32.26,115.32 32.26,83.82 30.99,82.55 30.99,77.22 30.73,76.96 30.73,57.15 30.99,56.9 30.99,54.86 31.24,54.61 31.24,42.93 29.72,41.4 v29.72,32 | E10.11 43.18,65.79 45.72,68.33 E10.3 45.72,71.63 45.97,71.88 45.97,79.25 43.94,81.28 43.94,82.3 43.82,82.42 | E4.4 71.12,36.32 69.34,38.1 69.34,39.12 68.07,40.39 66.8,40.39 65.53,41.66 65.53,44.2 65.02,44.7 65.02,44.96 64.77,45.21 64.77,46.23 63.5,47.5 63.25,47.5 61.98,46.23 61.98,41.4 62.23,41.15 62.23,40.13 61.47,39.37 60.45,39.37 59.69,40.13 59.69,41.15 59.94,41.4 59.94,50.8 60.2,51.05 60.2,61.47 v59.94,61.72 | v18.03,32 18.03,33.53 15.75,35.81 8.13,35.81 U$1.AM1 | v17.02,64.26 17.02,63.75 16.51,63.75 16.51,72.64 17.02,73.15 17.02,80.26 8.13,80.26 U$1.BC1
  Bottom 0.406: v59.94,61.72 44.2,61.72 44.07,61.85 | 44.07,61.85 43.94,61.98 43.94,63.5 E10.11 | v18.03,32 18.29,32.26 29.46,32.26 v29.72,32 | v17.02,64.26 17.02,63.75 18.54,63.75 19.05,63.25 19.05,61.72 43.94,61.72 44.07,61.85
AM2  (via drill 0.81)
  Top 0.406: v45.72,38.1 E6.3 | E9.3 E12.12 101.6,69.34 102.87,70.61 102.87,99.57 101.6,100.84 E18.3 E21.12 | E5.5 96.52,37.85 96.77,38.1 96.77,43.69 95.25,45.21 95.25,46.23 97.79,48.77 v97.79,52.07 | v61.72,33.02 v61.72,37.59
  Bottom 0.406: U$1.AM2 8.13,35.81 15.49,35.81 16,35.31 32,35.31 34.04,37.34 39.37,37.34 39.88,37.85 45.47,37.85 v45.72,38.1 45.72,37.85 61.47,37.85 v61.72,37.59 | v97.79,52.07 99.57,52.07 100.84,53.34 E9.3 | E17.2 75.44,106.68 73.91,105.16 68.33,105.16 67.31,106.17 67.31,107.95 69.34,107.95 70.36,108.97 92.2,108.97 92.71,108.46 99.31,108.46 101.09,106.68 E18.3 | v61.72,33.02 61.98,33.27 74.42,33.27 74.93,33.78 80.26,33.78 80.77,34.29 81.79,34.29 82.04,34.04 89.66,34.04 89.92,33.78 93.98,33.78 95.76,35.56 E5.5
AN1  (via drill 0.81)
  Top 0.406: v44.45,36.58 43.94,36.58 43.69,36.83 42.67,36.83 41.91,36.07 41.91,35.05 40.13,33.27 40.13,29.21 39.37,28.45 39.37,19.81 39.12,19.56 39.12,18.29 38.35,17.53 35.31,17.53 13.72,39.12 8.13,39.12 U$1.AN1
  Bottom 0.406: E4.6 65.28,35.56 64.01,36.83 62.99,36.83 62.48,36.32 61.47,36.32 60.96,36.83 45.21,36.83 44.96,36.58 v44.45,36.58
AN2  (via drill 0.81)
  Top 0.406: v43.94,41.91 43.94,43.43 42.93,44.45 40.64,44.45 E7.10 40.64,51.56 39.37,52.83 39.37,53.85 37.85,55.37 37.85,62.74 38.1,62.99 E10.9 38.1,64.01 37.85,64.26 37.85,69.09 39.37,70.61 39.37,71.63 39.62,71.88 39.62,78.74 v39.12,79.25
  Bottom 0.406: E10.2 47.75,71.12 41.4,64.77 40.13,64.77 38.86,63.5 E10.9 | v43.94,41.91 42.42,41.91 41.91,42.42 17.53,42.42 14.22,39.12 8.13,39.12 U$1.AN2 | v39.12,79.25 28.96,79.25 26.92,81.28 16.51,81.28 14.22,83.57 8.13,83.57 U$1.BD2
AP2  (via drill 0.81)
  Top 0.406: E7.9 38.1,44.96 39.88,43.18 v42.67,43.18
  Bottom 0.406: v42.67,43.18 42.42,43.43 15.49,43.43 14.22,42.16 8.13,42.16 U$1.AP2
AR2
  Top 0.406: E10.5 41.91,69.85 41.91,62.99 42.67,62.23 44.45,62.23 | 44.45,62.23 44.45,65.79 46.99,68.33 46.99,79.5 45.72,80.77 E13.12 | E7.13 46.99,44.45 44.45,44.45 44.45,62.23
  Bottom 0.406: U$1.AR2 8.64,44.7 34.8,44.7 35.05,44.45 46.99,44.45 E7.13
AS2
  Bottom 0.406: E8.2 71.88,49.02 63.5,49.02 62.48,48.01 61.98,48.01 61.72,48.26 60.71,48.26 60.45,48.51 8.13,48.51 U$1.AS2
AT2  (via drill 0.81)
  Top 0.406: v74.93,101.6 74.93,88.39 74.68,88.14 74.68,84.33 73.66,83.31 E14.12 v73.66,77.72 | E21.2 104.14,116.08 102.87,114.81 102.87,113.79 104.14,112.52 E18.2 | E8.9 66.04,50.29 v64.77,51.56 64.77,51.31 64.52,51.56 64.52,52.58 64.77,52.83 64.77,53.85 64.52,54.1 64.52,61.72 64.77,61.98 v64.77,65.28 64.52,65.53 64.52,70.36 64.77,70.61 64.77,71.63 64.52,71.88 64.52,77.22 v64.77,77.47
  Bottom 0.406: v74.93,101.6 75.18,101.85 82.04,101.85 82.3,102.11 104.9,102.11 105.16,101.85 105.66,101.85 106.68,102.87 106.68,104.9 106.43,104.9 104.65,106.68 E18.2 | v64.77,51.56 61.72,51.56 61.47,51.82 54.1,51.82 53.85,52.07 52.83,52.07 52.32,51.56 34.04,51.56 33.27,52.32 16,52.32 15.49,51.82 8.13,51.82 U$1.AT2 | E12.11 98.3,63.5 96.52,65.28 v64.77,65.28 | v73.66,77.72 65.02,77.72 v64.77,77.47
AU1  (via drill 0.81)
  Top 0.406: E4.1 78.74,37.85 78.49,38.1 78.49,43.69 80.01,45.21 v80.01,49.28 | v84.33,49.28 84.33,54.36 85.85,55.88 85.85,102.11 88.9,105.16 88.9,113.54 89.15,113.79 89.15,115.06 89.66,115.57 89.66,121.92 91.44,123.7 93.98,123.7 E21.6 | v30.73,126.75 30.73,116.33 30.23,115.82 30.23,84.33 28.96,83.06 28.96,77.72 28.7,77.47 28.7,66.8 21.34,59.44 21.34,47.75 21.59,47.5 21.59,45.97 20.07,45.97 19.05,46.99 19.05,47.5 19.3,47.75 19.3,54.86 8.13,54.86 U$1.AU1
  Bottom 0.406: v80.01,49.28 80.26,49.02 84.07,49.02 v84.33,49.28 | v30.73,126.75 47.5,126.75 48.01,126.24 65.79,126.24 66.29,126.75 66.8,126.75 68.33,125.22 72.14,125.22 72.64,124.71 94.23,124.71 95.25,123.7 96.52,123.7 97.79,122.43 97.79,121.41 97.03,120.65 96.01,120.65 95.5,121.16 95.25,121.16 94.49,121.92 E21.6
AU2  (via drill 0.81)
  Top 0.406: v59.94,63.25 60.2,63.5 60.2,67.56 59.94,67.82 59.94,79.25 61.21,80.52 61.21,115.06 61.72,115.57 61.72,121.92 61.85,122.05 | 61.85,122.05 62.99,123.19 64.01,123.19 64.77,122.43 64.77,121.41 66.04,120.14 E20.9 | v29.72,54.61 29.72,77.22 29.97,77.47 29.97,82.8 31.24,84.07 31.24,115.57 31.75,116.08 31.75,124.21 33.27,125.73 42.67,125.73 44.7,123.7 61.72,123.7 61.72,122.17 61.85,122.05
  Bottom 0.406: E20.9 E20.10 | E12.8 84.58,63.5 82.8,61.72 61.47,61.72 v59.94,63.25 | v29.72,54.61 29.46,54.36 16,54.36 15.49,54.86 8.13,54.86 U$1.AU2
AV2  (via drill 0.81)
  Top 0.406: E16.13 49.02,99.06 49.4,99.44 | 49.4,99.44 50.8,100.84 E16.1 | E10.1 50.8,78.23 48.26,80.77 E13.13 48.26,82.8 50.8,85.34 E13.1 50.8,97.28 49.53,98.55 49.53,99.31 49.4,99.44 | E8.13 76.2,48.01 76.45,48.26 76.45,49.02 76.96,49.53 76.96,52.32 77.47,52.83 77.47,53.85 77.72,54.1 77.72,57.91 v77.47,58.17 | v40.64,59.44 E10.10
  Bottom 0.406: E10.10 41.4,63.5 47.24,69.34 49.78,69.34 51.05,70.61 51.05,71.12 E10.1 | E5.13 104.14,28.45 105.66,29.97 105.66,35.56 E5.1 112.78,41.66 112.78,55.12 105.66,55.12 104.65,56.13 95.76,56.13 94.74,57.15 93.22,57.15 92.2,58.17 80.26,58.17 77.72,60.71 60.45,60.71 59.94,60.2 58.67,60.2 57.66,59.18 57.66,57.66 | v77.47,58.17 69.09,58.17 68.83,57.91 65.28,57.91 65.02,57.66 57.66,57.66 | 57.66,57.66 46.99,57.66 44.96,59.69 40.64,59.69 | 40.64,59.69 21.59,59.69 21.08,59.18 18.8,59.18 18.54,58.93 9.4,58.93 8.64,58.17 8.13,58.17 U$1.AV2 | 40.64,59.69 v40.64,59.44
BE2  (via drill 0.81)
  Top 0.406: E14.2 76.2,83.06 74.93,81.79 74.93,27.43 76.2,26.16 E2.2 | E21.5 96.52,118.62 100.33,114.81 100.33,113.79 100.08,113.54 100.08,107.44 100.33,107.19 100.33,106.17 100.08,105.92 100.08,99.82 100.33,99.57 100.33,98.55 100.08,98.3 100.08,90.93 v100.33,90.68 | v22.35,86.61 22.1,86.87 22.1,103.38 22.35,103.63 22.35,104.39 22.1,104.65 v22.1,124.21
  Bottom 0.406: E14.9 66.8,81.28 73.15,87.63 74.17,87.63 75.44,88.9 E14.2 76.96,88.9 78.74,90.68 v100.33,90.68 101.6,90.68 103.38,88.9 E15.2 | v22.35,86.61 8.13,86.61 U$1.BE2 | v22.1,124.21 22.35,123.95 33.02,123.95 33.78,124.71 46.99,124.71 47.5,124.21 71.88,124.21 72.39,123.7 93.98,123.7 95.76,121.92 E21.5
BF1  (via drill 0.81)
  Top 0.406: E17.3 73.66,104.39 73.15,103.89 73.15,100.58 72.64,100.08 72.64,99.82 72.39,99.57 72.39,97.54 72.14,97.28 72.14,91.95 73.66,90.42 E14.3 73.66,84.58 71.88,82.8 71.88,82.55 71.12,81.79 E14.11 71.12,80.77 71.88,80.01 71.88,79.76 72.14,79.5 72.14,74.93 73.66,73.41 E11.3 73.66,65.28 72.39,64.01 72.39,62.99 73.91,61.47 73.91,54.1 73.66,53.85 E8.3 73.66,48.77 71.12,46.23 E8.11 | E5.3 101.6,37.85 101.35,38.1 101.35,43.69 102.87,45.21 v102.87,48.01 | v20.32,47.24 20.32,59.44 19.05,60.71 19.05,67.56 17.53,69.09 17.53,69.6 18.03,70.1 18.03,89.15 17.53,89.66 17.53,89.92 8.13,89.92 U$1.BF1
  Bottom 0.406: E5.11 101.09,29.97 101.09,35.56 E5.3 | v102.87,48.01 63.75,48.01 62.61,46.86 | 62.61,46.86 62.48,46.74 62.48,46.48 62.23,46.23 62.23,45.21 62.99,44.45 69.09,44.45 69.85,45.21 70.1,45.21 70.61,45.72 E8.11 | v20.32,47.24 20.57,47.5 60.45,47.5 60.71,47.24 61.72,47.24 61.98,46.99 62.48,46.99 62.61,46.86
BF2  (via drill 0.81)
  Top 0.406: v76.2,77.22 E11.2 | v61.21,68.07 v61.21,50.55 | E15.4 E18.11 | v18.8,89.92 19.05,89.66 19.05,69.6 v18.8,69.34
  Bottom 0.406: E18.12 E18.11 | v76.2,77.22 76.45,76.96 84.33,76.96 89.92,82.55 91.95,82.55 98.04,88.65 98.55,88.65 98.81,88.9 E15.4 | E8.5 68.07,53.34 65.02,50.29 64.52,50.29 64.26,50.55 v61.21,50.55 | E11.2 75.44,71.12 73.66,69.34 67.56,69.34 66.55,68.33 61.47,68.33 v61.21,68.07 61.21,68.33 58.17,68.33 55.88,66.04 54.36,66.04 54.36,67.56 54.61,67.82 54.61,69.09 53.34,70.36 53.09,70.36 53.09,73.91 52.32,74.68 43.94,74.68 43.69,74.93 42.67,74.93 39.37,71.63 39.37,70.61 38.1,69.34 v18.8,69.34 | v18.8,89.92 8.13,89.92 U$1.BF2
BH1  (via drill 0.81)
  Top 0.406: E15.1 106.68,97.28 105.41,98.55 v105.41,103.12 | v15.49,108.71 15.49,94.74 13.72,92.96 8.13,92.96 U$1.BH1
  Bottom 0.406: v105.41,103.12 85.85,103.12 85.09,103.89 84.58,103.89 84.07,103.38 83.82,103.38 83.57,103.12 82.04,103.12 81.79,102.87 75.18,102.87 73.91,104.14 68.07,104.14 67.31,104.9 61.98,104.9 60.71,106.17 57.4,106.17 57.15,105.92 56.64,105.92 52.58,109.98 16.51,109.98 15.49,108.97 v15.49,108.71
BH2  (via drill 0.81)
  Top 0.406: E8.1 78.74,61.72 77.47,62.99 77.47,64.01 78.74,65.28 E11.1 78.74,77.22 76.2,79.76 E14.13 76.2,81.79 76.96,82.55 76.96,82.8 78.74,84.58 E14.1 78.74,94.23 76.2,96.77 E17.13 76.2,99.82 78.74,102.36 E17.1 | v16,92.96 16,93.98 16.51,94.49 16.51,108.2 v17.02,108.71
  Bottom 0.406: v16,92.96 8.13,92.96 U$1.BH2 | v17.02,108.71 17.27,108.97 52.32,108.97 56.39,104.9 57.4,104.9 57.66,105.16 60.45,105.16 61.72,103.89 67.06,103.89 67.82,103.12 71.37,103.12 75.44,99.06 E17.13
BJ2  (via drill 0.81)
  Top 0.406: E17.9 66.04,96.77 65.53,96.27 65.53,90.93 v65.79,90.68 | E18.1 106.68,112.52 105.41,113.79 105.41,114.81 106.68,116.08 E21.1 106.68,122.68 107.7,122.68 111,119.38 111,115.57 111.51,115.06 111.51,83.06 | 111.51,83.06 v111.51,47.5 | 111.51,83.06 v111.25,83.06
  Bottom 0.406: 64.26,90.68 45.72,90.68 44.45,89.41 44.45,88.39 43.18,87.12 37.85,87.12 37.08,86.36 24.13,86.36 14.22,96.27 8.13,96.27 U$1.BJ2 | 64.26,90.68 v65.79,90.68 | E9.12 102.36,45.72 104.14,47.5 v111.51,47.5 | 64.26,90.68 64.26,89.92 64.77,89.41 64.77,88.39 64.26,87.88 64.26,82.3 64.77,81.79 64.77,80.77 65.53,80.01 69.09,80.01 69.85,80.77 69.85,81.79 71.12,83.06 81.28,83.06 83.06,81.28 83.06,79.5 77.47,79.5 76.45,78.49 75.95,78.49 74.93,77.47 74.93,75.95 88.65,75.95 90.93,78.23 91.44,78.23 92.71,79.5 93.98,79.5 95.25,80.77 95.25,81.79 96.52,83.06 96.77,83.06 97.03,83.31 111,83.31 v111.25,83.06
BK2
  Top 0.406: E19.13 49.53,113.03 49.53,102.87 E16.12
  Bottom 0.406: 40.64,97.79 E13.5 | 40.64,97.79 44.45,97.79 E16.12 | 40.64,97.79 35.05,97.79 34.29,98.55 8.89,98.55 8.13,99.31 U$1.BK2
BL2  (via drill 0.81)
  Top 0.406: E19.3 45.72,120.4 49.02,117.09 54.61,117.09 54.61,116.33 56.64,114.3 56.64,110.49 58.17,108.97 58.17,106.93 57.91,106.68 57.91,102.62 v58.17,102.36
  Bottom 0.406: E16.2 47.5,106.68 43.31,102.49 | 43.31,102.49 41.66,100.84 40.39,100.84 38.61,99.06 E16.9 | v58.17,102.36 43.43,102.36 43.31,102.49 | U$1.BL2 8.13,102.62 43.18,102.62 43.31,102.49
BM2  (via drill 0.81)
  Top 0.406: E20.12 E20.13 | E15.8 91.44,81.79 92.2,82.55 92.2,82.8 92.46,83.06 92.46,88.14 92.71,88.39 92.71,89.41 92.46,89.66 92.46,98.3 92.71,98.55 92.71,99.57 94.49,101.35 94.49,105.41 95.25,106.17 95.25,107.19 95.76,107.7 95.76,111 v96.01,111.25 | v23.37,105.66 23.11,105.92 23.11,113.03 v23.37,113.28
  Bottom 0.406: v96.01,111.25 95.76,111.51 91.19,111.51 90.42,112.27 83.31,112.27 83.06,112.52 78.49,112.52 76.71,114.3 E20.13 | v23.37,105.66 8.13,105.66 U$1.BM2 | v23.37,113.28 23.62,113.03 54.1,113.03 56.39,115.32 61.21,115.32 61.98,116.08 71.37,116.08 73.15,114.3 E20.12
BN2
  Bottom 0.406: E20.11 67.82,111 16,111 13.97,108.97 8.13,108.97 U$1.BN2
BP2
  Bottom 0.406: E20.8 61.21,112.01 8.13,112.01 U$1.BP2
BR1  (via drill 0.81)
  Top 0.406: E16.5 E19.10 | v45.72,60.45 E10.12 | v20.83,60.45 20.83,61.98 20.07,62.74 v20.07,103.89 20.07,108.97 13.72,115.32 8.13,115.32 U$1.BR1
  Bottom 0.406: v45.72,60.45 45.47,60.71 21.08,60.71 v20.83,60.45 | E16.5 40.64,103.63 20.32,103.63 v20.07,103.89
BR2
  Bottom 0.406: E19.9 36.83,115.57 8.38,115.57 8.13,115.32 U$1.BR2
BS1  (via drill 0.81)
  Top 0.406: U$1.BS1 8.13,118.36 14.22,118.36 v16.51,120.65 16.51,120.4 21.08,115.82 21.08,104.65 21.34,104.39 21.34,103.63 21.08,103.38 21.08,85.6 v21.34,85.34
  Bottom 0.406: 38.1,85.34 38.1,86.11 43.69,86.11 44.7,87.12 45.97,87.12 47.75,88.9 E13.2 | 38.1,85.34 E13.9 | E19.5 39.88,121.92 38.1,120.14 34.04,120.14 33.27,120.9 16.76,120.9 v16.51,120.65 | v21.34,85.34 38.1,85.34
BS2
  Bottom 0.406: E20.6 64.26,120.14 62.23,120.14 61.98,119.89 57.4,119.89 54.36,116.84 36.07,116.84 35.81,116.59 15.75,116.59 13.97,118.36 8.13,118.36 U$1.BS2
BT2  (via drill 0.81)
  Top 0.406: E20.5 E20.4 | v44.7,115.57 44.7,117.86 v44.45,118.11
  Bottom 0.406: E21.8 83.82,114.3 80.52,117.6 76.2,117.6 74.55,119.25 | 74.55,119.25 72.64,121.16 72.39,121.16 71.63,121.92 E20.4 | v44.7,115.57 44.96,115.82 54.36,115.82 54.61,116.08 54.86,116.08 57.66,118.87 61.98,118.87 62.23,119.13 74.42,119.13 74.55,119.25 | v44.45,118.11 44.2,117.86 36.07,117.86 35.81,117.6 17.78,117.6 13.72,121.67 8.13,121.67 U$1.BT2
BU1
  Top 0.406: E19.1 E19.2 | E20.3 67.56,128.02 16.76,128.02 16.76,127.25 14.48,124.97 8.13,124.97 U$1.BU1
  Bottom 0.406: E20.3 72.9,122.68 72.14,122.68 71.63,123.19 52.07,123.19 E19.1
BU2  (via drill 0.81)
  Top 0.406: v84.33,44.45 87.12,47.24 87.12,64.26 86.87,64.52 86.87,101.85 89.41,104.39 v89.66,104.39 | v66.55,125.48 66.55,123.19 67.31,122.43 67.31,120.4 67.06,120.14 67.06,115.06 67.31,114.81 67.31,113.79 68.58,112.52 E17.5
  Bottom 0.406: E17.5 69.34,106.68 70.61,107.95 91.95,107.95 93.22,106.68 E18.6 94.49,106.68 94.49,106.43 92.96,104.9 90.17,104.9 v89.66,104.39 | E8.12 74.42,45.72 76.2,43.94 80.26,43.94 80.77,44.45 v84.33,44.45 | v66.55,125.48 66.29,125.22 47.75,125.22 47.24,125.73 33.53,125.73 32.77,124.97 22.86,124.97 22.35,125.48 21.84,125.48 21.08,124.71 8.13,124.71 U$1.BU2
BV1  (via drill 0.81)
  Top 0.406: v83.57,99.06 83.57,104.9 82.3,106.17 82.3,113.54 82.55,113.79 82.55,114.81 78.74,118.62 E20.1 E20.2 v76.2,129.79 | v15.49,127.51 15.49,128.78 10.41,128.78 10.16,128.52 10.16,128.02 8.13,128.02 U$1.BV1
  Bottom 0.406: v83.57,99.06 E18.8 | v15.49,127.51 15.75,127.76 18.8,127.76 19.3,128.27 19.56,128.27 20.07,128.78 20.07,130.3 71.63,130.3 72.14,129.79 v76.2,129.79
BV2
  Top 0.406: 99.95,123.57 92.46,131.06 74.93,131.06 74.93,117.35 72.39,114.81 72.39,104.14 71.12,102.87 E17.11 | 99.95,123.57 E21.3 | E3.12 104.39,9.91 114.05,9.91 114.05,117.6 107.95,123.7 100.08,123.7 99.95,123.57
  Bottom 0.406: E6.12 53.59,20.07 61.98,20.07 66.29,15.75 98.55,15.75 E3.12 | E14.5 68.58,97.79 69.85,97.79 E17.11 | E21.3 92.2,131.32 19.05,131.32 19.05,129.29 18.54,128.78 8.89,128.78 8.13,128.02 U$1.BV2
GND  (via drill 0.81)
  Top 0.406: C15.2 109.22,86.87 110.24,87.88 110.24,98.3 110.49,98.55 110.49,99.57 110.24,99.82 110.24,102.62 110.11,102.74 | 110.11,102.74 109.22,103.63 C18.2 | C21.2 109.22,117.09 109.98,116.33 109.98,115.32 110.49,114.81 110.49,103.12 110.11,102.74 | C4.2 81.28,32.51 82.17,31.62 | 82.17,31.62 82.3,31.5 82.3,28.7 82.55,28.45 82.55,27.43 82.3,27.18 82.3,19.3 81.28,18.29 C2.2 | C5.2 109.22,32.51 110.24,31.5 110.24,28.7 110.49,28.45 110.49,27.43 110.24,27.18 110.24,19.3 109.22,18.29 C3.2 | E3.7 91.44,26.16 90.17,27.43 90.17,28.45 91.44,29.72 E5.7 91.44,43.94 90.17,45.21 90.17,46.23 91.44,47.5 E9.7 91.44,61.72 90.17,62.99 90.17,64.01 91.44,65.28 E12.7 91.44,76.2 91.19,76.45 91.19,79.76 90.17,80.77 90.17,81.79 91.44,83.06 E15.7 91.44,97.28 90.17,98.55 90.17,99.57 90.93,100.33 90.93,101.09 91.44,101.6 E18.7 91.44,112.52 90.17,113.79 90.17,114.81 91.44,116.08 E21.7 | C8.2 81.28,50.29 82.3,49.28 82.3,48.01 83.06,47.24 83.06,41.66 82.3,40.89 82.3,31.75 82.17,31.62 | E20.7 63.5,119.63 62.74,118.87 62.74,115.32 62.23,114.81 62.23,113.79 63.5,112.52 E17.7 63.5,104.39 63.25,104.14 v63.25,100.58 62.23,99.57 62.23,98.55 62.99,97.79 62.99,97.03 63.5,96.52 E14.7 63.5,83.06 62.23,81.79 62.23,80.77 63.5,79.5 E11.7 63.5,65.28 62.23,64.01 62.23,62.99 63.5,61.72 E8.7 63.5,49.02 62.36,47.88 | E2.7 63.5,26.16 62.23,27.43 62.23,28.45 63.5,29.72 E4.7 63.5,38.1 C23.2 | 62.36,47.88 60.96,46.48 R2.1 | E16.7 35.56,108.97 34.42,110.11 | 34.42,110.11 34.29,110.24 34.29,114.81 34.8,115.32 34.8,119.63 35.56,120.4 E19.7 | 34.42,73.28 35.56,72.14 E10.7 | 34.42,73.28 33.02,74.68 R4.1 33.02,82.04 34.29,83.31 34.29,85.34 34.42,85.47
  Top 0.406: E13.7 35.56,86.61 34.42,85.47 | 34.42,110.11 34.29,109.98 34.29,85.6 34.42,85.47 | v15.49,121.92 15.49,121.67 8.13,121.67 U$1.BT1 | C6.2 53.34,32.51 54.23,31.62 | 54.23,31.62 54.36,31.5 54.36,28.7 54.61,28.45 54.61,27.43 54.36,27.18 54.36,19.3 53.34,18.29 C1.2 53.34,17.27 54.36,16.26 54.36,13.46 54.61,13.21 54.61,12.19 54.36,11.94 54.36,9.14 53.34,8.13 C24.2 | E6.7 35.56,33.27 34.42,32.13 | 34.42,32.13 34.29,32 34.29,27.43 34.8,26.92 34.8,22.61 35.56,21.84 E1.7 | C7.2 53.34,50.29 54.23,49.4 | 54.23,49.4 54.36,49.28 54.36,46.48 54.61,46.23 54.61,32 54.23,31.62 | 34.42,32.13 34.29,32.26 34.29,49.78 35.56,51.05 E7.7 35.56,54.86 34.29,56.13 34.29,73.15 34.42,73.28 | C10.2 53.34,68.07 54.36,67.06 54.36,64.26 54.61,64.01 54.61,49.78 54.23,49.4 | v15.49,53.34 15.49,51.82 8.13,51.82 U$1.AT1 | v62.23,49.28 62.23,48.01 62.36,47.88
  Bottom 0.406: C20.2 86.61,119.38 86.74,119.51 | 86.74,119.51 89.15,121.92 E21.7 | C21.2 86.87,119.38 86.74,119.51 | C2.2 82.04,17.78 82.3,18.03 94.74,18.03 95,17.78 C3.2 | C8.2 86.61,50.8 86.74,50.93 | 86.74,50.93 89.15,53.34 E9.7 | C9.2 86.87,50.8 86.74,50.93 | C17.2 83.57,104.14 85.09,105.66 89.92,105.66 90.93,106.68 E18.7 | C14.2 86.61,86.36 89.15,88.9 E15.7 | 86.74,68.71 89.15,71.12 E12.7 | 86.74,68.71 86.61,68.58 C11.2 73.91,68.58 73.66,68.33 67.82,68.33 66.8,67.31 61.98,67.31 61.47,66.8 57.91,66.8 56.13,65.02 54.36,65.02 54.1,65.28 53.85,65.28 53.34,65.79 53.34,67.82 53.59,68.07 53.59,68.58 C10.2 | C12.2 86.87,68.58 86.74,68.71 | C19.2 55.63,119.38 57.15,120.9 61.98,120.9 62.99,121.92 E20.7 | C13.2 58.67,86.36 61.21,88.9 E14.7 | C16.2 60.96,99.06 62.48,100.58 v63.25,100.58 | R2.1 62.99,40.64 65.53,38.1 C23.2 | E10.7 35.56,72.39 36.83,73.66 C22.2 | R4.1 30.73,76.2 26.67,80.26 8.13,80.26 U$1.BC2 | E19.7 v15.49,121.92 | C25.2 52.07,5.08 52.07,6.35 C24.2 51.56,7.62 48.77,10.41 35.05,10.41 34.8,10.67 21.34,10.67 21.08,10.41 8.13,10.41 U$1.AC2 | E1.7 36.32,20.32 38.86,17.78 C1.2 | E7.7 v15.49,53.34 | v62.23,49.28 60.96,49.28 59.44,50.8 C7.2
N$1
  Top 0.406: E7.12 49.53,49.53 49.53,55.12 52.07,57.66 52.07,69.34 54.61,71.88 54.61,114.81 53.85,115.57 45.97,115.57 45.97,114.55 E19.12
N$2  (via drill 0.81)
  Top 0.406: v43.18,50.29 E7.11 | v46.99,50.29 46.99,53.85 49.78,56.64 49.78,62.74 49.53,62.99 49.53,64.01 49.78,64.26 49.78,70.36 49.53,70.61 49.53,71.63 49.78,71.88 49.78,77.98 46.99,80.77 46.99,81.79 46.23,82.55 46.23,86.61 46.74,87.12 46.74,88.14 46.99,88.39 46.99,89.41 46.74,89.66 46.74,91.44 45.21,92.96 45.21,97.54 44.7,98.04 44.7,98.3 44.45,98.55 44.45,99.57 44.96,100.08 44.96,100.58 45.21,100.84 45.21,103.38 46.74,104.9 46.74,105.92 46.99,106.17 46.99,107.19 46.74,107.44 46.74,110.24 43.18,113.79 E19.11
  Bottom 0.406: v43.18,50.29 43.43,50.55 46.74,50.55 v46.99,50.29
N$3  (via drill 0.81)
  Top 0.406: E19.8 35.56,113.79 36.83,112.52 36.83,47.5 35.56,46.23 E7.8 35.56,45.21 36.32,44.45 36.32,44.2 36.58,43.94 37.85,43.94 39.37,42.42 39.62,42.42 v42.67,39.37
  Bottom 0.406: E4.5 67.82,35.56 66.55,36.83 65.53,36.83 63.5,38.86 46.48,38.86 45.97,39.37 v42.67,39.37
VCC
  Top 0.406: C17.1 80.01,99.06 | 80.01,99.06 E17.14 | C20.1 80.01,114.3 | 80.01,114.3 E20.14 | 80.01,114.3 80.01,99.06 | C11.1 80.01,63.5 | 80.01,63.5 E11.14 | C14.1 80.01,81.28 | 80.01,81.28 E14.14 | 80.01,81.28 80.01,63.5 | 80.01,81.28 80.01,99.06 | C21.1 107.95,114.3 | 107.95,114.3 E21.14 | C15.1 107.95,81.28 | 107.95,81.28 E15.14 | C18.1 107.95,99.06 | 107.95,99.06 E18.14 | 107.95,99.06 107.95,81.28 | 107.95,99.06 107.95,114.3 | C3.1 107.95,12.7 | 107.95,12.7 E3.14 | C5.1 107.95,27.94 | 107.95,27.94 E5.14 | 107.95,27.94 107.95,12.7 | C9.1 107.95,45.72 | 107.95,45.72 E9.14 | C12.1 107.95,63.5 | 107.95,63.5 E12.14 | 107.95,63.5 107.95,45.72 | 107.95,45.72 107.95,27.94 | 107.95,63.5 107.95,81.28 | E19.14 C19.1 C16.1 53.34,101.6 E16.14 51.05,99.06 52.07,98.04 52.07,81.28 | 52.07,81.28 C13.1 R3.2 53.34,71.88 51.05,69.6 51.05,63.75 E10.14 | 52.07,81.28 E13.14 | C8.1 R1.2 80.01,41.91 80.01,27.94 | C2.1 80.01,12.7 | 80.01,12.7 E2.14 | 80.01,27.94 C4.1 81.28,22.1 80.01,20.83 80.01,12.7 | 80.01,27.94 E4.14 | C7.1 52.07,45.72 | 52.07,45.72 E7.14 | C6.1 52.07,27.94 | 52.07,27.94 E6.14 | C1.1 52.07,12.7 | 52.07,12.7 E1.14 | C24.1 52.07,3.81 52.07,12.7 | 52.07,12.7 52.07,27.94 | 52.07,27.94 52.07,45.72 | C10.1 53.09,63.25 53.09,52.32 52.07,51.31 52.07,45.72
  Bottom 0.406: C17.1 82.55,100.33 105.41,100.33 E18.14 | C10.1 E10.14 | U$1.BA2 8.64,74.68 37.34,74.68 42.67,80.01 49.53,80.01 E13.14 | C8.1 E8.14 | C24.1 38.35,2.54 35.81,5.08 C25.1 35.81,4.83 8.64,4.83 U$1.AA2 | E2.14 77.47,11.43 54.61,11.43 C1.1 | E9.14 104.14,43.18 R1.2